# EAGLE design tqfp44 (EAGLE 8.3.1)
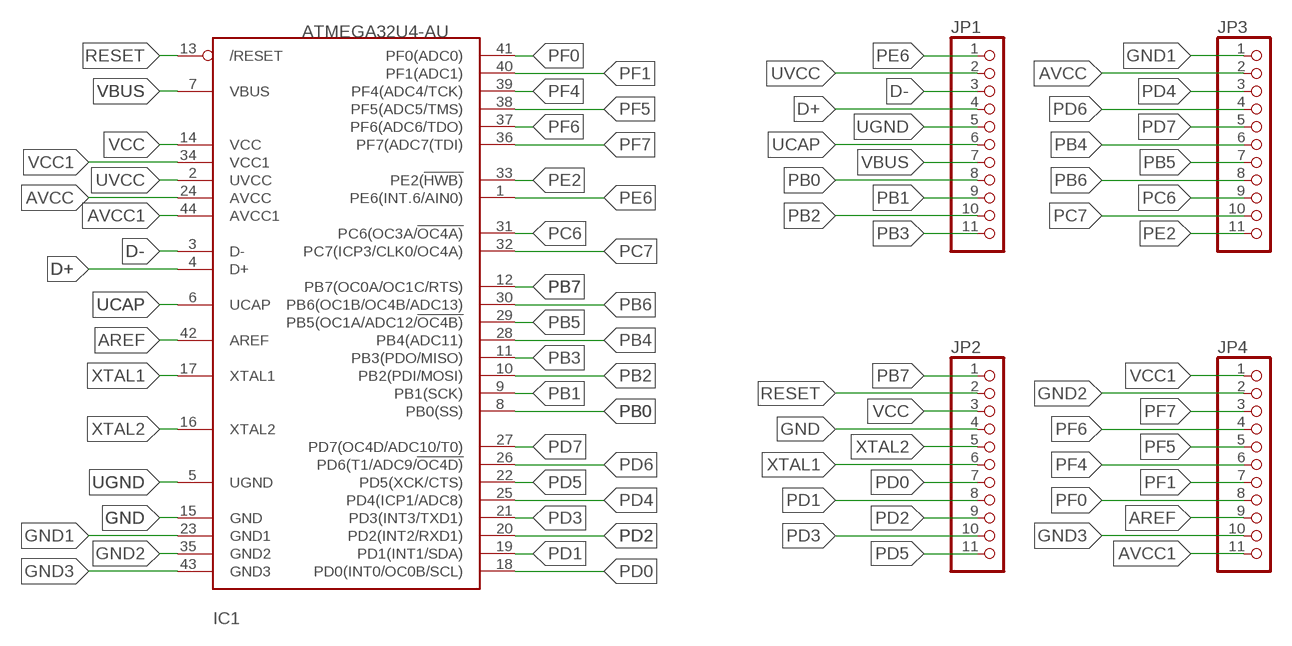
[diagram p0: schematic, sheet 1]

## Parts
IC1  ATMEGA32U4-AU  [TQFP44]
JP1  THROUHOLE11  [THROUHOLE11]
JP2  THROUHOLE11  [THROUHOLE11]
JP3  THROUHOLE11  [THROUHOLE11]
JP4  THROUHOLE11  [THROUHOLE11]

## Nets
AREF: IC1.42(AREF) JP4.9
AVCC: IC1.24(AVCC) JP3.2
AVCC1: IC1.44(AVCC1) JP4.11
D+: IC1.4(D+) JP1.4
D-: IC1.3(D-) JP1.3
GND: IC1.15(GND) JP2.4
GND1: IC1.23(GND1) JP3.1
GND2: IC1.35(GND2) JP4.2
GND3: IC1.43(GND3) JP4.10
PB0: IC1.8(PB0(SS)) JP1.8
PB1: IC1.9(PB1(SCK)) JP1.9
PB2: IC1.10(PB2(PDI/MOSI)) JP1.10
PB3: IC1.11(PB3(PDO/MISO)) JP1.11
PB4: IC1.28(PB4(ADC11)) JP3.6
PB5: IC1.29(PB5(OC1A/ADC12/!OC4B)) JP3.7
PB6: IC1.30(PB6(OC1B/OC4B/ADC13)) JP3.8
PB7: IC1.12(PB7(OC0A/OC1C/RTS)) JP2.1
PC6: IC1.31(PC6(OC3A/!OC4A)) JP3.9
PC7: IC1.32(PC7(ICP3/CLK0/OC4A)) JP3.10
PD0: IC1.18(PD0(INT0/OC0B/SCL)) JP2.7
PD1: IC1.19(PD1(INT1/SDA)) JP2.8
PD2: IC1.20(PD2(INT2/RXD1)) JP2.9
PD3: IC1.21(PD3(INT3/TXD1)) JP2.10
PD4: IC1.25(PD4(ICP1/ADC8)) JP3.3
PD5: IC1.22(PD5(XCK/CTS)) JP2.11
PD6: IC1.26(PD6(T1/ADC9/!OC4D)) JP3.4
PD7: IC1.27(PD7(OC4D/ADC10/T0)) JP3.5
PE2: IC1.33(PE2(!HWB)) JP3.11
PE6: IC1.1(PE6(INT.6/AIN0)) JP1.1
PF0: IC1.41(PF0(ADC0)) JP4.8
PF1: IC1.40(PF1(ADC1)) JP4.7
PF4: IC1.39(PF4(ADC4/TCK)) JP4.6
PF5: IC1.38(PF5(ADC5/TMS)) JP4.5
PF6: IC1.37(PF6(ADC6/TDO)) JP4.4
PF7: IC1.36(PF7(ADC7(TDI)) JP4.3
RESET: IC1.13(/RESET) JP2.2
UCAP: IC1.6(UCAP) JP1.6
UGND: IC1.5(UGND) JP1.5
UVCC: IC1.2(UVCC) JP1.2
VBUS: IC1.7(VBUS) JP1.7
VCC: IC1.14(VCC) JP2.3
VCC1: IC1.34(VCC1) JP4.1
XTAL1: IC1.17(XTAL1) JP2.6
XTAL2: IC1.16(XTAL2) JP2.5

## Library data of the parts
IC1 = avr:ATMEGA32U4: http://www.ladyada.net/library/eagle
JP1-JP4 = pinhead-half-pitch:THROUHOLE11

## Board
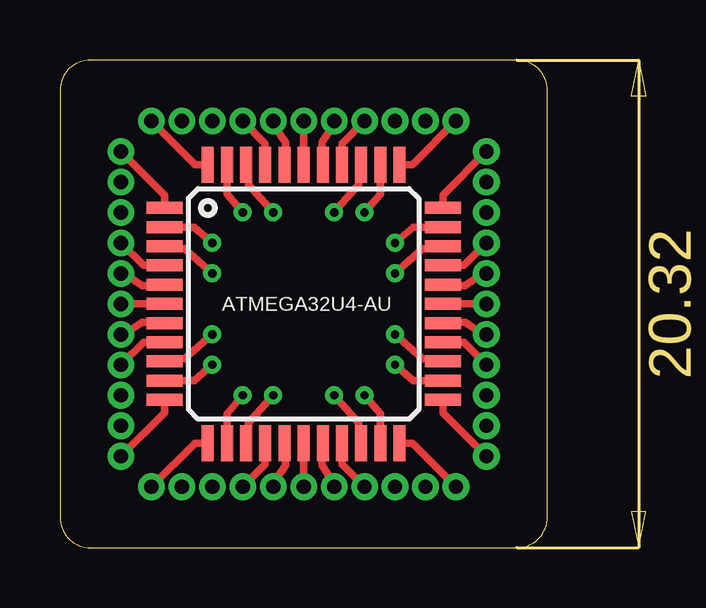
[diagram p1: board, top side]
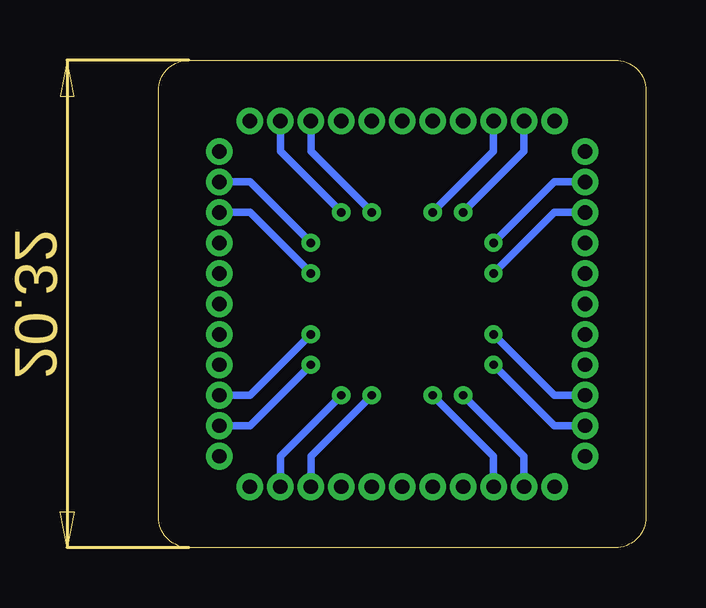
[diagram p2: board, bottom side, seen from below]

Size 20.32 x 20.32 mm. Coordinates in mm from the lower left corner, seen from the top.
Outline: 1.27,0 19.05,0 arc90 20.32,1.27 20.32,19.05 arc90 19.05,20.32 1.27,20.32 arc90 0,19.05 0,1.27 arc90 1.27,0
Copper layers (1*16): Top 0.035mm / dielectric 1.5mm / Bottom 0.035mm
Design rules "default *": minimum track width 6mil, minimum drill 0.35mm, track to track 6mil, track to pad 6mil, pad to pad 6mil, via to via 6mil, smd to smd 6mil, copper to edge 40mil, drill to drill 6mil, minimum pad ring 10mil, minimum via ring 8mil, stop-mask expansion 4mil, vias tented up to drill 0mil, thermal gap 10mil

### Footprints (pad centres in the part's own frame; a part is rotated, then mirrored left to right if it is on the bottom)
TQFP44 = smd 1.5 x 0.5: 1 -5.8,4; 2 -5.8,3.2; 3 -5.8,2.4; 4 -5.8,1.6; 5 -5.8,0.8; 6 -5.8,0; 7 -5.8,-0.8; 8 -5.8,-1.6; 9 -5.8,-2.4; 10 -5.8,-3.2; 11 -5.8,-4; 23 5.8,-4; 24 5.8,-3.2; 25 5.8,-2.4; 26 5.8,-1.6; 27 5.8,-0.8; 28 5.8,0; 29 5.8,0.8; 30 5.8,1.6; 31 5.8,2.4; 32 5.8,3.2; 33 5.8,4 | smd 0.5 x 1.5: 12 -4,-5.8; 13 -3.2,-5.8; 14 -2.4,-5.8; 15 -1.6,-5.8; 16 -0.8,-5.8; 17 0,-5.8; 18 0.8,-5.8; 19 1.6,-5.8; 20 2.4,-5.8; 21 3.2,-5.8; 22 4,-5.8; 34 4,5.8; 35 3.2,5.8; 36 2.4,5.8; 37 1.6,5.8; 38 0.8,5.8; 39 0,5.8; 40 -0.8,5.8; 41 -1.6,5.8; 42 -2.4,5.8; 43 -3.2,5.8; 44 -4,5.8
THROUHOLE11 = drill 0.6: 1 -6.35,0; 2 -5.08,0; 3 -3.81,0; 4 -2.54,0; 5 -1.27,0; 6 0,0; 7 1.27,0; 8 2.54,0; 9 3.81,0; 10 5.08,0; 11 6.35,0

### Placement (x,y rotation side)
IC1  10.16,10.16 0 top
JP1  2.54,10.16 270 top
JP2  10.16,2.54 0 top
JP3  17.78,10.16 90 top
JP4  10.16,17.78 180 top

### Tracks (layer width: path | path; a pad name or v marks a point on that pad's centre or on a via)
AREF  (via drill 0.35)
  Top 0.305: IC1.42 7.87,15.11 v8.89,13.97
  Bottom 0.305: JP4.9 6.35,16.51 v8.89,13.97
AVCC  (via drill 0.35)
  Top 0.305: IC1.24 14.73,6.96 v13.97,7.62
  Bottom 0.305: v13.97,7.62 16.51,5.08 JP3.2
AVCC1
  Top 0.305: IC1.44 5.63,15.96 JP4.11
D+
  Top 0.305: IC1.4 3.48,11.76 JP1.4
D-  (via drill 0.35)
  Top 0.305: IC1.3 5.21,12.45 v6.35,11.43
  Bottom 0.305: JP1.3 3.81,13.97 v6.35,11.43
GND
  Top 0.305: IC1.15 8.56,3.48 JP2.4
GND1
  Top 0.305: IC1.23 15.96,5.63 JP3.1
GND2  (via drill 0.35)
  Top 0.305: IC1.35 13.36,14.73 v12.7,13.97
  Bottom 0.305: v12.7,13.97 15.24,16.51 JP4.2
GND3  (via drill 0.35)
  Top 0.305: IC1.43 6.96,14.73 v7.62,13.97
  Bottom 0.305: v7.62,13.97 5.08,16.51 JP4.10
PB0
  Top 0.305: IC1.8 3.48,8.56 JP1.8
PB1  (via drill 0.35)
  Top 0.305: IC1.9 5.21,7.87 v6.35,8.89
  Bottom 0.305: JP1.9 3.81,6.35 v6.35,8.89
PB2  (via drill 0.35)
  Top 0.305: IC1.10 5.59,6.96 v6.35,7.62
  Bottom 0.305: v6.35,7.62 3.81,5.08 JP1.10
PB3
  Top 0.305: IC1.11 4.36,5.63 JP1.11
PB4
  Top 0.305: JP3.6 IC1.28
PB5
  Top 0.305: JP3.7 17.65,11.43 16.89,10.92 16.05,10.92 IC1.29
PB6
  Top 0.305: IC1.30 16.84,11.76 JP3.8
PB7
  Top 0.305: IC1.12 5.63,4.36 JP2.1
PC6  (via drill 0.35)
  Top 0.305: IC1.31 15.11,12.45 v13.97,11.43
  Bottom 0.305: JP3.9 16.51,13.97 v13.97,11.43
PC7  (via drill 0.35)
  Top 0.305: IC1.32 14.73,13.36 v13.97,12.7
  Bottom 0.305: v13.97,12.7 16.51,15.24 JP3.10
PD0
  Top 0.305: JP2.7 11.43,2.67 10.92,3.43 10.92,4.27 IC1.18
PD1
  Top 0.305: IC1.19 11.76,3.48 JP2.8
PD2  (via drill 0.35)
  Top 0.305: IC1.20 12.45,5.21 v11.43,6.35
  Bottom 0.305: JP2.9 13.97,3.81 v11.43,6.35
PD3  (via drill 0.35)
  Top 0.305: IC1.21 13.36,5.59 v12.7,6.35
  Bottom 0.305: v12.7,6.35 15.24,3.81 JP2.10
PD4  (via drill 0.35)
  Top 0.305: IC1.25 15.11,7.87 v13.97,8.89
  Bottom 0.305: JP3.3 16.51,6.35 v13.97,8.89
PD5
  Top 0.305: IC1.22 14.69,4.36 JP2.11
PD6
  Top 0.305: IC1.26 16.84,8.56 JP3.4
PD7
  Top 0.305: JP3.5 17.65,8.89 16.89,9.4 16.05,9.4 IC1.27
PE2
  Top 0.305: IC1.33 15.96,14.69 JP3.11
PE6
  Top 0.305: IC1.1 4.36,14.69 JP1.1
PF0
  Top 0.305: IC1.41 8.56,16.84 JP4.8
PF1
  Top 0.305: JP4.7 8.89,17.65 9.4,16.89 9.4,16.05 IC1.40
PF4
  Top 0.305: JP4.6 IC1.39
PF5
  Top 0.305: JP4.5 11.43,17.65 10.92,16.89 10.92,16.05 IC1.38
PF6
  Top 0.305: IC1.37 11.76,16.84 JP4.4
PF7  (via drill 0.35)
  Top 0.305: IC1.36 12.45,15.11 v11.43,13.97
  Bottom 0.305: JP4.3 13.97,16.51 v11.43,13.97
RESET  (via drill 0.35)
  Top 0.305: IC1.13 6.96,5.59 v7.62,6.35
  Bottom 0.305: v7.62,6.35 5.08,3.81 JP2.2
UCAP
  Top 0.305: JP1.6 IC1.6
UGND
  Top 0.305: JP1.5 2.67,11.43 3.43,10.92 4.27,10.92 IC1.5
UVCC  (via drill 0.35)
  Top 0.305: IC1.2 5.59,13.36 v6.35,12.7
  Bottom 0.305: v6.35,12.7 3.81,15.24 JP1.2
VBUS
  Top 0.305: JP1.7 2.67,8.89 3.43,9.4 4.27,9.4 IC1.7
VCC  (via drill 0.35)
  Top 0.305: IC1.14 7.87,5.21 v8.89,6.35
  Bottom 0.305: JP2.3 6.35,3.81 v8.89,6.35
VCC1
  Top 0.305: IC1.34 14.69,15.96 JP4.1
XTAL1
  Top 0.305: JP2.6 IC1.17
XTAL2
  Top 0.305: JP2.5 8.89,2.67 9.4,3.43 9.4,4.27 IC1.16